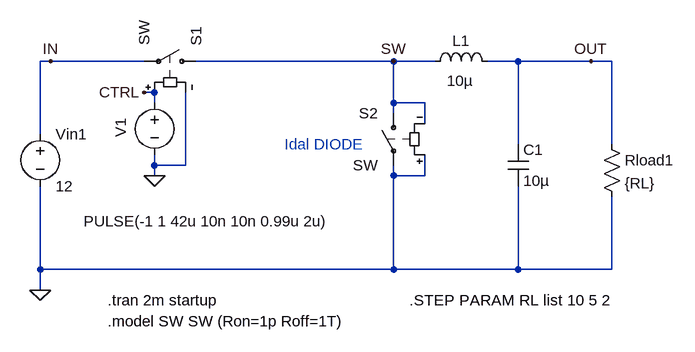
[diagram p0: schematic Fig_7-2_Buck_Ideal_Current_1.asc]
Fig_7-2_Buck_Ideal_Current_1.asc, the LTspice schematic file:
Version 4
SHEET 1 880 680
WIRE -992 -448 -1008 -448
WIRE -848 -448 -992 -448
WIRE -464 -448 -768 -448
WIRE -400 -448 -464 -448
WIRE -272 -448 -320 -448
WIRE -160 -448 -272 -448
WIRE -128 -448 -160 -448
WIRE -832 -400 -848 -400
WIRE -832 -384 -832 -400
WIRE -464 -384 -464 -448
WIRE -416 -384 -464 -384
WIRE -464 -368 -464 -384
WIRE -416 -352 -416 -384
WIRE -1008 -336 -1008 -448
WIRE -272 -320 -272 -448
WIRE -128 -320 -128 -448
WIRE -832 -288 -832 -304
WIRE -784 -288 -784 -400
WIRE -784 -288 -832 -288
WIRE -832 -272 -832 -288
WIRE -464 -272 -464 -288
WIRE -416 -272 -416 -304
WIRE -416 -272 -464 -272
WIRE -1008 -128 -1008 -256
WIRE -464 -128 -464 -272
WIRE -464 -128 -1008 -128
WIRE -272 -128 -272 -256
WIRE -272 -128 -464 -128
WIRE -128 -128 -128 -240
WIRE -128 -128 -272 -128
WIRE -1008 -96 -1008 -128
FLAG -1008 -96 0
FLAG -160 -448 OUT
FLAG -992 -448 IN
FLAG -464 -448 SW
FLAG -848 -400 CTRL
FLAG -832 -272 0
SYMBOL sw -752 -448 M270
SYMATTR InstName S1
SYMBOL ind -416 -432 R270
WINDOW 0 32 56 VTop 2
WINDOW 3 2 54 VBottom 2
SYMATTR InstName L1
SYMATTR Value 10µ
SYMBOL cap -288 -320 R0
SYMATTR InstName C1
SYMATTR Value 10µ
SYMBOL voltage -1008 -352 R0
WINDOW 123 0 0 Left 2
WINDOW 39 0 0 Left 2
SYMATTR InstName Vin1
SYMATTR Value 12
SYMBOL voltage -832 -400 M0
WINDOW 123 0 0 Left 2
WINDOW 39 0 0 Left 2
WINDOW 0 52 40 VRight 2
WINDOW 3 109 198 Right 2
SYMATTR InstName V1
SYMATTR Value PULSE(-1 1 42u 10n 10n 0.99u 2u)
SYMBOL res -144 -336 R0
SYMATTR InstName Rload1
SYMATTR Value {RL}
SYMBOL sw -464 -384 M0
SYMATTR InstName S2
TEXT -904 -48 Left 2 !.model SW SW (Ron=1p Roff=1T)
TEXT -904 -80 Left 2 !.tran 2m startup
TEXT -440 -80 Left 2 !.STEP PARAM RL list 10 5 2
TEXT -632 -320 Left 2 ;Idal DIODE

The netlist it stands for:
* Fig_7-2_Buck_Ideal_Current_1.asc
S1 SW IN CTRL 0 SW
L1 SW OUT 10µ
C1 OUT 0 10µ
Vin1 IN 0 12
V1 CTRL 0 PULSE(-1 1 42u 10n 10n 0.99u 2u)
Rload1 OUT 0 {RL}
S2 SW 0 0 SW SW
.model SW SW (Ron=1p Roff=1T)
.tran 2m startup
.STEP PARAM RL list 10 5 2
* Idal DIODE
.backanno
.end